# Altium schematic sheet STM32G431C6T6.SchDoc
size B; SheetNumber: 2; SheetTotal: 6
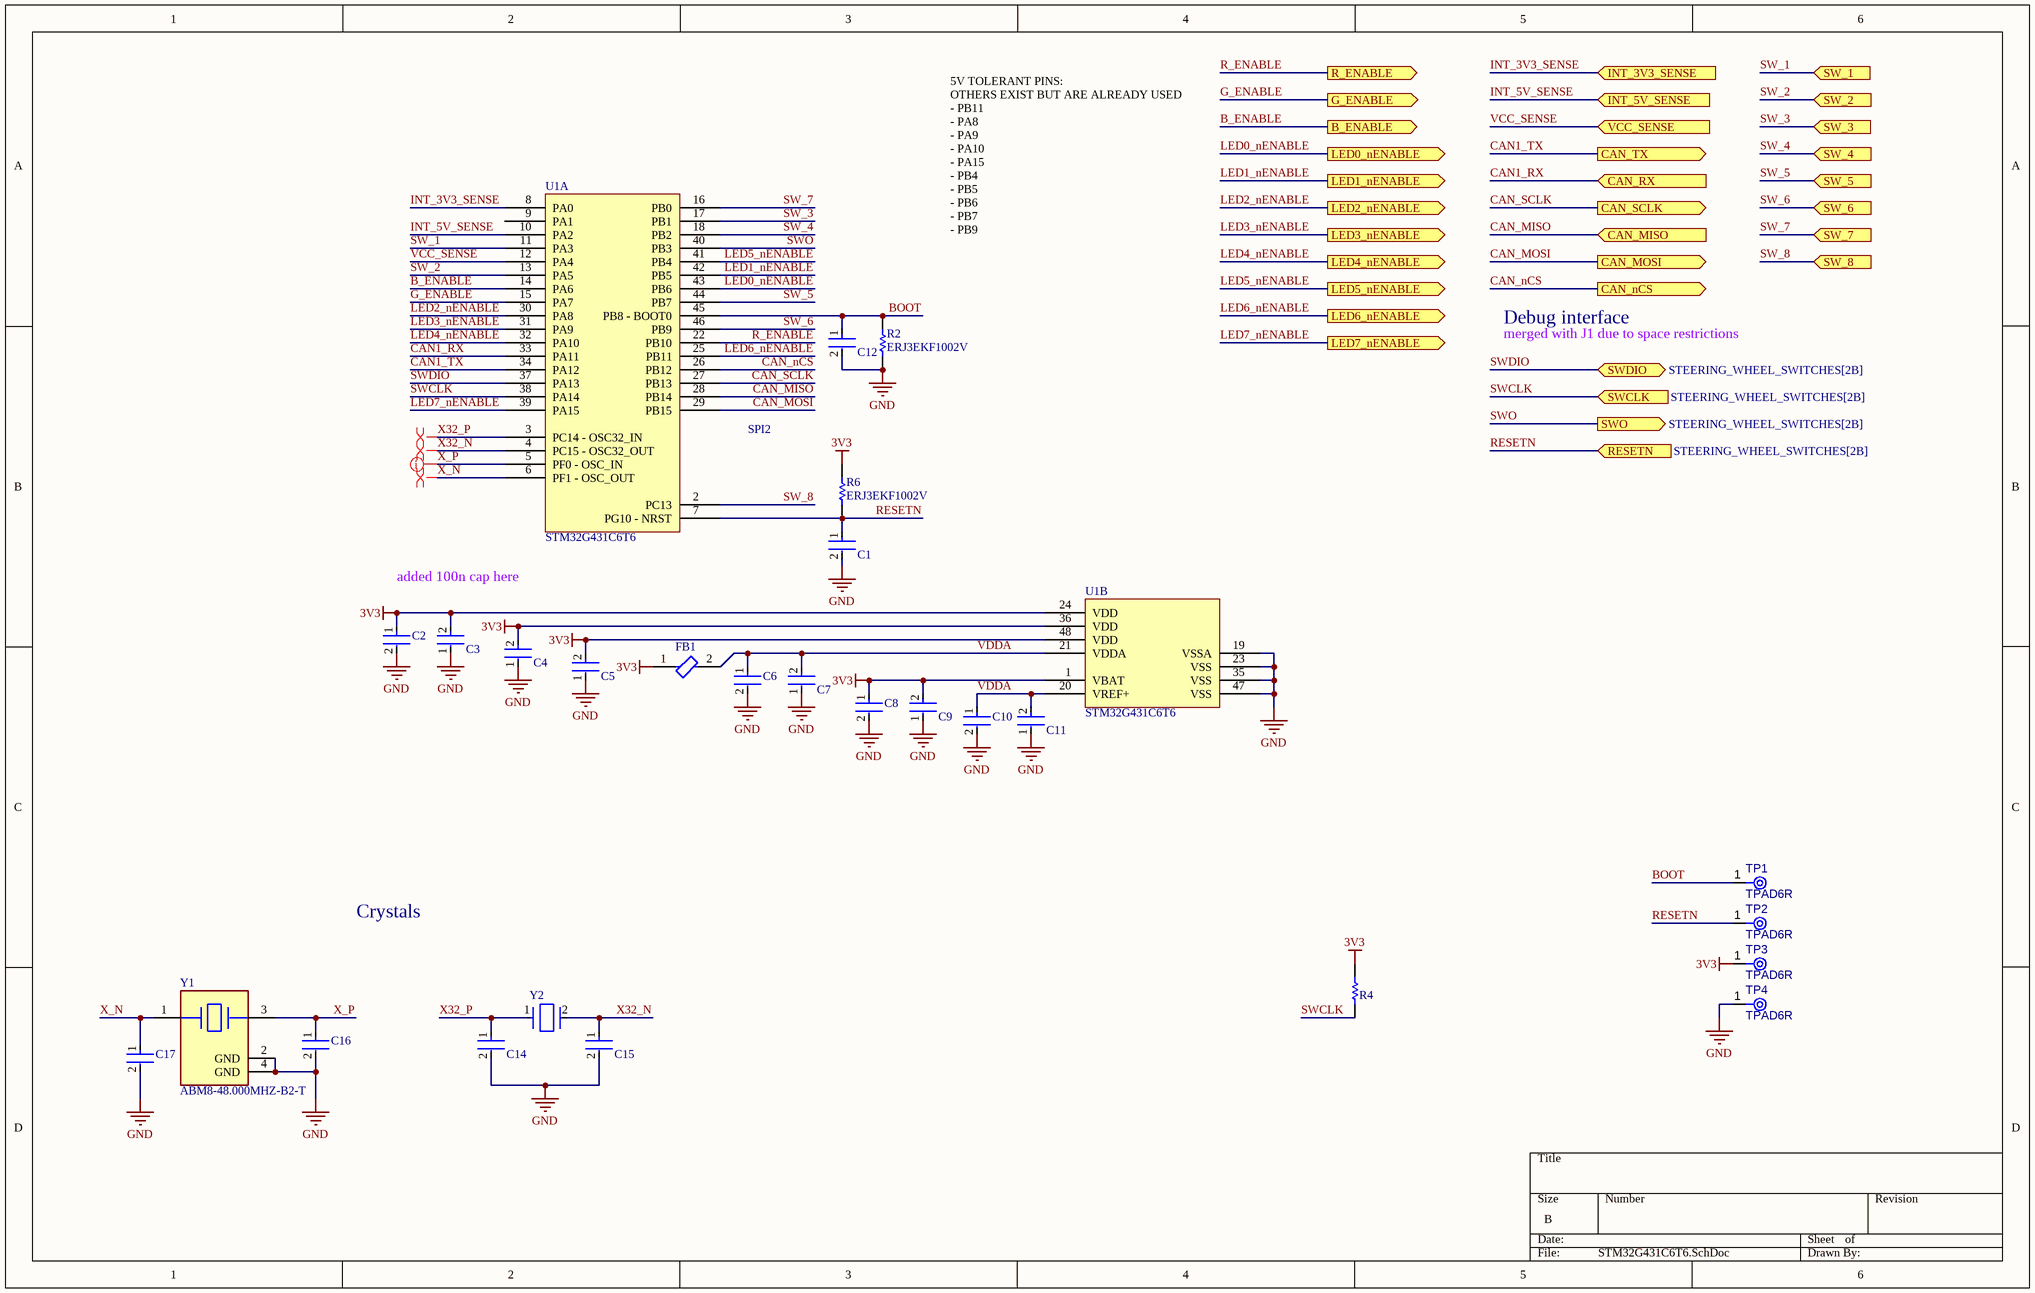
[diagram p0: STM32G431C6T6.SchDoc]

## Parts
C1  C0402C104K8PACTU  [FP-C0402-BB-MFG]  (value not drawn)
C2  C1005X5R1A475K050BC  [FP-C1005-050-0_15-MFG]  (value not drawn)
C3  GRM155R71C104KA88D  [FP-GRM15-MFG]  (value not drawn)
C4  GRM155R71C104KA88D  [FP-GRM15-MFG]  (value not drawn)
C5  GRM155R71C104KA88D  [FP-GRM15-MFG]  (value not drawn)
C6  EMK105BJ105KV-F  [FP-0402-L_1_0_0_05-W_0_5-IPC_A]  (value not drawn)
C7  GRM155R71C104KA88D  [FP-GRM15-MFG]  (value not drawn)
C8  EMK105BJ105KV-F  [FP-0402-L_1_0_0_05-W_0_5-IPC_A]  (value not drawn)
C9  GRM155R71C104KA88D  [FP-GRM15-MFG]  (value not drawn)
C10  EMK105BJ105KV-F  [FP-0402-L_1_0_0_05-W_0_5-IPC_A]  (value not drawn)
C11  GRM155R71C104KA88D  [FP-GRM15-MFG]  (value not drawn)
C12  C0402C104K8PACTU  [FP-C0402-BB-MFG]  (value not drawn)
C14  04025A180FAT2A  [FP-0402-L_1_0_1-W_0_5_0_1-IPC_A]  (value not drawn)
C15  04025A180FAT2A  [FP-0402-L_1_0_1-W_0_5_0_1-IPC_A]  (value not drawn)
C16  C0402C689C5GACTU  [FP-C0402-BB-MFG]  (value not drawn)
C17  C0402C689C5GACTU  [FP-C0402-BB-MFG]  (value not drawn)
FB1  BLM15PX601SN1D  [FP-BLM15-0_05-MFG]  (value not drawn)
R2  ERJ3EKF1002V  [RESC1609X55X30LL15T15]
R4  ERJ3EKF1002V  [RESC1609X55X30LL15T15]  (value not drawn)
R6  ERJ3EKF1002V  [RESC1609X55X30LL15T15]
TP1  TPAD6R  [TP06R]  (no BOM)
TP2  TPAD6R  [TP06R]  (no BOM)
TP3  TPAD6R  [TP06R]  (no BOM)
TP4  TPAD6R  [TP06R]  (no BOM)
U1  STM32G431C6T6  [TSQFP50P900X900X160-48N]  (parts A,B of 2)
Y1  ABM8-48.000MHZ-B2-T  [FP-ABM8-MFG]
Y2  ECS-.327-12.5-1210-TR  [FP-ECX-1210-MFG]  (value not drawn)

## Ports
B_ENABLE (out, see STEERING_WHEEL_SWITCHES[2B], LED_ARRAY[1B]), CAN_MISO (in, see STEERING_WHEEL_SWITCHES[2B], CAN_IF[1A]), CAN_MOSI (out, see STEERING_WHEEL_SWITCHES[2B], CAN_IF[1A]), CAN_nCS (out, see STEERING_WHEEL_SWITCHES[2B], CAN_IF[1A]), CAN_RX (in, see STEERING_WHEEL_SWITCHES[2B], CAN_IF[1A]), CAN_SCLK (out, see STEERING_WHEEL_SWITCHES[2B], CAN_IF[1A]), CAN_TX (out, see STEERING_WHEEL_SWITCHES[2B], CAN_IF[1A]), G_ENABLE (out, see STEERING_WHEEL_SWITCHES[2B], LED_ARRAY[1B]), INT_3V3_SENSE (in, see STEERING_WHEEL_SWITCHES[2A], PWR_MGMT[4B]), INT_5V_SENSE (in, see STEERING_WHEEL_SWITCHES[2A], PWR_MGMT[4C]), LED0_nENABLE (out, see STEERING_WHEEL_SWITCHES[2B], LED_ARRAY[1A]), LED1_nENABLE (out, see STEERING_WHEEL_SWITCHES[2B], LED_ARRAY[1A]), LED2_nENABLE (out, see STEERING_WHEEL_SWITCHES[2C], LED_ARRAY[1A]), LED3_nENABLE (out, see STEERING_WHEEL_SWITCHES[2C], LED_ARRAY[1A]), LED4_nENABLE (out, see STEERING_WHEEL_SWITCHES[2C], LED_ARRAY[1B]), LED5_nENABLE (out, see STEERING_WHEEL_SWITCHES[2C], LED_ARRAY[1B]), LED6_nENABLE (out, see STEERING_WHEEL_SWITCHES[2C], LED_ARRAY[1B]), LED7_nENABLE (out, see STEERING_WHEEL_SWITCHES[2C], LED_ARRAY[1B]), R_ENABLE (out, see STEERING_WHEEL_SWITCHES[2B], LED_ARRAY[1B]), RESETN (in, see STEERING_WHEEL_SWITCHES[2B]), SW_1 (in, see STEERING_WHEEL_SWITCHES[2A]), SW_2 (in, see STEERING_WHEEL_SWITCHES[2A]), SW_3 (in, see STEERING_WHEEL_SWITCHES[2A]), SW_4 (in, see STEERING_WHEEL_SWITCHES[2A]), SW_5 (in, see STEERING_WHEEL_SWITCHES[2B]), SW_6 (in, see STEERING_WHEEL_SWITCHES[2B]), SW_7 (in, see STEERING_WHEEL_SWITCHES[2B]), SW_8 (in, see STEERING_WHEEL_SWITCHES[2B]), SWCLK (in, see STEERING_WHEEL_SWITCHES[2B]), SWDIO (bidir, see STEERING_WHEEL_SWITCHES[2B]), SWO (out, see STEERING_WHEEL_SWITCHES[2B]), VCC_SENSE (in, see STEERING_WHEEL_SWITCHES[2A], PWR_MGMT[3C])

## Nets
3V3: C2.1 C3.2 C4.2 C5.2 C8.1 C9.2 FB1.1 R4.1 R6.1 TP3.1(TP) U1.1(VBAT) U1.24(VDD) U1.36(VDD) U1.48(VDD)
GND: C1.2 C2.2 C3.1 C4.1 C5.1 C6.2 C7.1 C8.2 C9.1 C10.2 C11.1 C12.2 C14.2 C15.2 C16.2 C17.2 R2.1 TP4.1(TP) U1.19(VSSA) U1.23(VSS) U1.35(VSS) U1.47(VSS) Y1.2(GND) Y1.4(GND)
B_ENABLE: U1.14(PA6) ; port B_ENABLE
BOOT: C12.1 R2.2 TP1.1(TP) U1.45(PB8_-_BOOT0)
CAN1_RX: U1.33(PA11) ; port CAN_RX
CAN1_TX: U1.34(PA12) ; port CAN_TX
CAN_MISO: U1.28(PB14) ; port CAN_MISO
CAN_MOSI: U1.29(PB15) ; port CAN_MOSI
CAN_nCS: U1.26(PB12) ; port CAN_nCS
CAN_SCLK: U1.27(PB13) ; port CAN_SCLK
G_ENABLE: U1.15(PA7) ; port G_ENABLE
INT_3V3_SENSE: U1.8(PA0) ; port INT_3V3_SENSE
INT_5V_SENSE: U1.10(PA2) ; port INT_5V_SENSE
LED0_nENABLE: U1.43(PB6) ; port LED0_nENABLE
LED1_nENABLE: U1.42(PB5) ; port LED1_nENABLE
LED2_nENABLE: U1.30(PA8) ; port LED2_nENABLE
LED3_nENABLE: U1.31(PA9) ; port LED3_nENABLE
LED4_nENABLE: U1.32(PA10) ; port LED4_nENABLE
LED5_nENABLE: U1.41(PB4) ; port LED5_nENABLE
LED6_nENABLE: U1.25(PB11) ; port LED6_nENABLE
LED7_nENABLE: U1.39(PA15) ; port LED7_nENABLE
R_ENABLE: U1.22(PB10) ; port R_ENABLE
RESETN: C1.1 R6.2 TP2.1(TP) U1.7(PG10_-_NRST) ; port RESETN
SW_1: U1.11(PA3) ; port SW_1
SW_2: U1.13(PA5) ; port SW_2
SW_3: U1.17(PB1) ; port SW_3
SW_4: U1.18(PB2) ; port SW_4
SW_5: U1.44(PB7) ; port SW_5
SW_6: U1.46(PB9) ; port SW_6
SW_7: U1.16(PB0) ; port SW_7
SW_8: U1.2(PC13) ; port SW_8
SWCLK: R4.2 U1.38(PA14) ; port SWCLK
SWDIO: U1.37(PA13) ; port SWDIO
SWO: U1.40(PB3) ; port SWO
VCC_SENSE: U1.12(PA4) ; port VCC_SENSE
VDDA: C6.1 C7.2 C10.1 C11.2 FB1.2 U1.20(VREF+) U1.21(VDDA)
X32_N: C15.1 U1.4(PC15_-_OSC32_OUT) Y2.2(Out/In)
X32_P: C14.1 U1.3(PC14_-_OSC32_IN) Y2.1(In/Out)
X_N: C17.1 U1.6(PF1_-_OSC_OUT) Y1.1
X_P: C16.1 U1.5(PF0_-_OSC_IN) Y1.3

Not connected (* = marked no-connect by the designer): U1 9(PA1)

## Layout directives
differential pair: X32_N, X32_P, X_N, X_P

## Notes on the sheet
- 5V TOLERANT PINS:
  OTHERS EXIST BUT ARE ALREADY USED
  - PB11
  - PA8
  - PA9
  - PA10
  - PA15
  - PB4
  - PB5
  - PB6
  - PB7
  - PB9
  - PC13
- Debug interface
- merged with J1 due to space restrictions
- SPI2
- added 100n cap here
- Crystals

## Library data of the parts
C1 C12 = CMP-2008-02046-2: CAP CER 0.1UF 10V X5R 0402; Manufacturer: Kemet; Material: Ceramic; Capacitance: 0.10 μF; Temperature Coefficient: 15%; Tolerance: 0.1; Value: 0.10 μF; Package: C0402-BB; Temperature: -55°C to +125°C; ComponentLink2Description: Datasheet; Temperature Characteristic: X5R; Device Class L1: Passive Components; Height: 0.55mm; Lead Free: Yes; ComponentLink2URL: https://content.kemet.com/datasheets/KEM_C1002_X7R_SMD.pdf; Device Class L2: Capacitors; Temperature Range Low: -55°C; Temperature Range High: +125°C; RoHS: TRUE; Octopart: https://octopart.com/c0402c104k8pactu-kemet-140039; Automotive: No; Mouser Description: Capacitor 100 nF 10 VDC 0402; Category: Cap; Voltage Rating: 10 V; Digikey Description: CAP CER 0.1UF 10V X5R 0402; Ipc Land Pattern Name: CAPC10050X50; Device Class L3: Ceramic Capacitors; Manufacturer Part Number: C0402C104K8PACTU
C2 = CMP-2000-05997-2: CAP CER 4.7UF 10V X5R 0402; Dielectric Material: Ceramic; Tolerance: 10%; Series: C; Package Quantity: 10000; Max Operating Temperature: 85°C; Case Code (Imperial): 0402; Lead Free: Lead Free; Voltage Rating (DC): 10V; Packaging: Cut Tape; Voltage Rating: 10V; Min Operating Temperature: -55°C; Dielectric: X5R; Thickness: 0.022inch; Width: 0.02inch; Case/Package: 0402; Case Code (Metric): 1005; Capacitance: 4.7uF; Length: 0.039inch; RoHS Compliant: Yes; REACH SVHC: No SVHC; Mount: Surface Mount
C3-C5 C7 C9 C11 = CMP-2100-03641-2: CAP CER 0.1UF 16V X7R 0402; Manufacturer: Murata; Standoff Height: 0mm; Tolerance: 10%; Voltage Rating: 16Vdc; Material: Ceramic; Capacitance: 0.10μF; Value: 0.10μF; RoHS: TRUE; Manufacturer Part Number: GRM155R71C104KA88D; Temperature Characteristic: X7R; Octopart: https://octopart.com/grm155r71c104ka88d-murata-196880; Digikey Description: CAP CER 0.1UF 16V X7R 0402; Device Class L3: Ceramic Capacitors; Height: 0.55mm; ComponentLink2Description: Datasheet; Temperature Range Low: -55°C; Ipc Land Pattern Name: CAPC10050X219; ComponentLink2URL: https://search.murata.co.jp/Ceramy/image/img/A01X/G101/ENG/GRM155R71H471KA01-01A.pdf; Device Class L1: Passive Components; Lead Free: yes; Category: Cap; Package: GRM15; Temperature: -55°C to +125°C; Device Class L2: Capacitors; Temperature Range High: +125°C; Mouser Description: 0402 0.1 uF 16V ±10 % Tolerance X7R SMT Multilayer Ceramic Capacitor
C6 C8 C10 = CMP-14477-000104-2: None; Tolerance: 10%; Voltage Rating: 16V; Dielectric: X5R; Capacitance: 1uF; Packaging: Tape and Reel; Depth: 0.5mm; Mount: Surface Mount; Thickness: 0.022inch; Package Quantity: 1; Min Operating Temperature: -55°C; Series: M; Voltage Rating (DC): 16V; Termination: SMD/SMT; Case/Package: 0402; Number of Pins: 2; Case Code (Imperial): 0402; Length: 1mm; Halogen Free: Halogen Free; Case Code (Metric): 1005; Width: 0.02inch; RoHS Compliant: Yes; Radiation Hardening: No; Max Operating Temperature: 85°C; Height: 0.5mm; Construction: Flat
C14 C15 = CMP-2008-02590-2: General Purpose Ceramic Capacitor, 0402, 18pF, 1%, C0G, 30ppm/°C, 50V; Depth: 0.5mm; Packaging: Tape and Reel; Number of Pins: 2; Tolerance: 1%; Min Operating Temperature: -55°C; Capacitance: 18pF; Termination: SMD/SMT; Lead Free: Lead Free; Case Code (Metric): 1005; Radiation Hardening: No; Package Quantity: 1; Max Operating Temperature: 125°C; Voltage Rating: 50V; Construction: Flat; Dielectric: C0G; Length: 1mm; REACH SVHC: No SVHC; Case Code (Imperial): 0402; Series: -; RoHS Compliant: Yes; Voltage Rating (DC): 50V; Mount: Surface Mount; Case/Package: 0402; Width: 0.5mm; Thickness: 0.022inch; Contact Plating: Tin
C16 C17 = CMP-1034-00517-3: CAP CER 6.8PF 50V NP0 0402; Manufacturer: Kemet; Material: Ceramic; Temperature Characteristic: C0G; Tolerance: 0.25 pF; Temperature Coefficient: 15%; ComponentLink2URL: https://content.kemet.com/datasheets/KEM_C1002_X7R_SMD.pdf; Octopart: https://octopart.com/c0402c689c5gactu-kemet-9143567; RoHS: TRUE; Temperature: -55°C to +125°C; Device Class L2: Capacitors; ComponentLink2Description: Datasheet; Mouser Description: Cap Ceramic 6.8pF 50V C0G 0.25pF SMD 0402 125°C Paper T/R; Device Class L3: Ceramic Capacitors; Digikey Description: CAP CER 6.8PF 50V NP0 0402; Temperature Range High: +125°C; Package: C0402-BB; Voltage Rating: 50 V; Height: 0.55mm; Ipc Land Pattern Name: CAPC10050X50; Value: 6.8 pF; Device Class L1: Passive Components; Category: Cap; Manufacturer Part Number: C0402C689C5GACTU; Capacitance: 6.8 pF; Lead Free: Yes; Automotive: No; Temperature Range Low: -55°C
FB1 = CMP-0686-00252-4: Chip Ferrite Bead, 0402, 600Ω @ 100MHz, 0.23Ω, 25%, 900mA; Number of Circuits: 1; Impedance: 600R; DC Resistance (DCR): 230mR; Material: Steel; Length: 1mm; Package Quantity: 10000; Height: 0.5mm; Width: 0.5mm; Max DC Current: 900mA; Number of Lines: 1; Termination: SMD/SMT; Packaging: Tape and Reel; Lead Free: Lead Free; Min Operating Temperature: -55°C; Max Operating Temperature: 125°C; Max Current Rating: 900mA; Case Code (Imperial): 0402; Number of Pins: 2; Current Rating: 900mA; Test Frequency: 100MHz; Case/Package: 0402; Tolerance: 25%; Case Code (Metric): 1005
R2 R4 R6 = CMP-1012-00623-3: Chip Resistor, 10 KOhm, +/- 1%, 0.1 W, -55 to 155 degC, 0603 (1608 Metric), RoHS, Tape and Reel; Manufacturer: Panasonic; Voltage Rating: 75V; Case\/Package: 0603; Power Rating: 100mW; Resistance: 10KOhm; Temperature Coefficient: 100ppm\/degreesC; Number of Pins: 2; Package Reference: 603; Depth: 0.8mm; Mount: SurfaceMount; Package Description: 2-Pin Surface Mount Device, Body 1.6 x 0.85 mm; Datasheet Version: 02/2017; Length: 1.6mm; Lead Free: LeadFree; Height: 0.45mm; Number of Terminations: 2; Max Power Dissipation: 100mW; Min Operating Temperature: -55degC; Datasheet URL: https://industrial.panasonic.com/cdbs/www-data/pdf/RDA0000/AOA0000C304.pdf; Termination: SMD/SMT; Case Code (Metric): 1608; Case Code (Imperial): 0603; Tolerance: 1%; Max Operating Temperature: 155degC; RoHSCompliant: true; Voltage Rating (DC): 75V; Radiation Hardening: No; Packaging: TapeandReel; Composition: ThickFilm; Mounting Technology: SurfaceMount; Manufacturer URL: http://www.panasonic.com/; Width: 0.031inch; REACH SVHC: NoSVHC; Contact Plating: Tin; Military Standard: Not; Package Quantity: 1
TP1-TP4 = CMP-00028-00002-3: 0.6mm round; Pins: 1
U1 = CMP-020-00017-1: IC MCU 32BIT 32KB FLASH 48LQFP; RoHS Compliant: Yes
Y1 = CMP-27762-011708-1: Crystal 48MHz ±20ppm 18pF SMD-4 3.2mm x 2.5mm; Series Resistance: 35R; Frequency Stability: 50ppm; Package Quantity: 1000; Packaging: Tape and Reel; Mount: Surface Mount; Length: 3.2mm; Load Capacitance: 18pF; Max Operating Temperature: 70°C; Operating Frequency: 48 MHz; RoHS Compliant: Yes; Series: ABM8; Frequency Tolerance: 20ppm; Lead Free: Lead Free; Min Operating Temperature: -20°C; Case/Package: CSMD; Number of Pins: 4; Height: 0.031inch; ESR (Equivalent Series Resistance): 35R; Frequency: 48MHz; Radiation Hardening: No; Width: 0.098inch; Tolerance: 20ppm; Termination: SMD/SMT; Depth: 2.5mm; Resistor Type: Ceramic; REACH SVHC: No SVHC
Y2 = CMP-40224-000006-1: CRYSTAL 32.7680KHZ 12.5PF SMD; Manufacturer: ECS International; Frequency: 32.768kHz; Esr: 90kΩ; Tolerance: 20ppm; Device Class L1: Passive Components; Load Capacitance: 12.5pF; Temperature: -40°C to +85°C; ComponentLink2URL: https://ecsxtal.com/store/pdf/ECX-1210.pdf; Series: ECX-1210; Octopart: https://octopart.com/ecs-.327-12.5-1210-tr-ecs+international-81221340; ComponentLink2Description: Datasheet; Temperature Range Low: -40°C; Digikey Description: CRYSTAL 32.7680KHZ 12.5PF SMD; Lead Free: Yes; RoHS: TRUE; Device Class L3: Crystals; Automotive: No; Category: Crys; Height: 0.5mm; Manufacturer Part Number: ECS-.327-12.5-1210-TR; Temperature Range High: +85°C; Device Class L2: Crystals / Oscillators; Package: ECX-1210